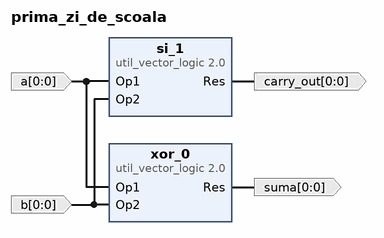
[diagram p0: block diagram of the top level]
# Vivado block design prima_zi_de_scoala, xc7a100tcsg324-1, Vivado 2019.2.1
create_bd_design prima_zi_de_scoala

create_bd_port -dir O -from 0 -to 0 carry_out
create_bd_port -dir I -from 0 -to 0 a
create_bd_port -dir I -from 0 -to 0 b
create_bd_port -dir O -from 0 -to 0 suma

create_bd_cell -type ip -vlnv xilinx.com:ip:util_vector_logic:2.0 xor_0
set_property -dict {CONFIG.C_OPERATION xor CONFIG.C_SIZE 1} [get_bd_cells xor_0]
create_bd_cell -type ip -vlnv xilinx.com:ip:util_vector_logic:2.0 si_1
set_property -dict {CONFIG.C_SIZE 1} [get_bd_cells si_1]

# ---- connections ----

connect_bd_net -net util_vector_logic_1_Res [get_bd_pins si_1/Res] [get_bd_ports carry_out]
connect_bd_net -net Op1_0_1 [get_bd_ports a] [get_bd_pins xor_0/Op1] [get_bd_pins si_1/Op1]
connect_bd_net -net Op2_0_1 [get_bd_ports b] [get_bd_pins xor_0/Op2] [get_bd_pins si_1/Op2]
connect_bd_net -net util_vector_logic_0_Res [get_bd_pins xor_0/Res] [get_bd_ports suma]

validate_bd_design
save_bd_design
